# EAGLE design IRsens (EAGLE 9.3.2)
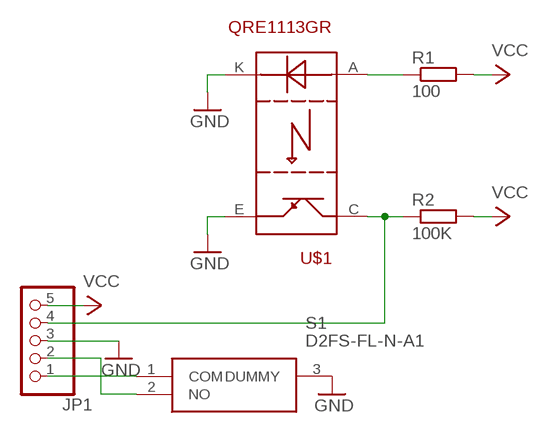
[diagram p0: schematic, sheet 1]

## Parts
JP1  PINHD-1X5  [1X05]
R1  100  R-EU_R0805  [R0805]
R2  100K  R-EU_R0805  [R0805]
S1  D2FS-FL-N-A1  [D2FS-FL-N-A1]
U$1  QRE1113GR  [4LEADSMD]

## Nets
GND: JP1.3 S1.3(DUMMY) U$1.E U$1.K
N$1: R1.1 U$1.A
N$2: JP1.4 R2.1 U$1.C
N$3: JP1.2 S1.2(NO)
N$4: JP1.1 S1.1(COM)
VCC: JP1.5 R1.2 R2.2

## Library data of the parts
JP1 = pinhead:PINHD-1X5: PIN HEADER
R1 R2 = rcl:R-EU_: RESISTOR, European symbol; SPICEPREFIX: R
S1 = D2FS-FL-N-A1:D2FS-FL-N-A1: Microswitch, SPST-NO, lever operated, right angle Source: Datasheet <http://uk.rs-online.com/web/p/products/8046183>; ALLIED_NUMBER: 70454797; DESCRIPTION: Microswitch, SPST-NO, lever operated, right angle; HEIGHT: mm; MANUFACTURER_NAME: Omron Electronics; MANUFACTURER_PART_NUMBER: D2FS-FL-N-A1; RS_PART_NUMBER: 8046183; RS_PRICE-STOCK: http://uk.rs-online.com/web/p/products/8046183
U$1 = QRE1113GR:QRE1113GR; AVAILABILITY: Unavailable; DESCRIPTION: QRE1113 Series 30 V 50 mA Miniature Reflective Object Sensor - SMD-4; MF: ON Semiconductor; MP: QRE1113GR; PACKAGE: SMD-4 ON Semiconductor; PRICE: None

## Board
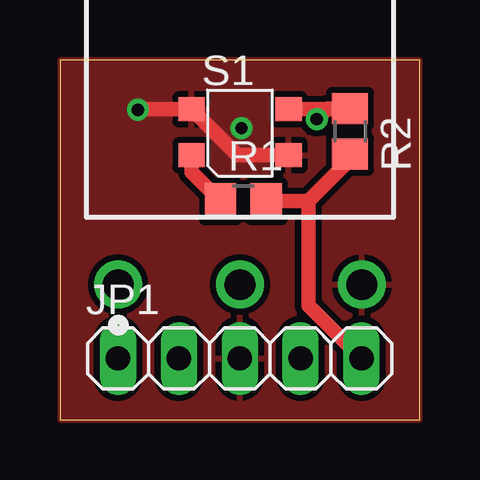
[diagram p1: board, top side]
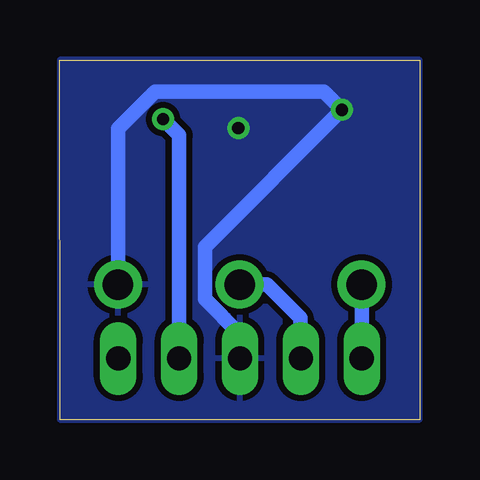
[diagram p2: board, bottom side, seen from below]

Size 15.01 x 15 mm. Coordinates in mm from the lower left corner, seen from the top.
Outline: 0,0 15,0 15.01,15 0,15 0,0
Copper layers (1*16): Top 0.035mm / dielectric 1.5mm / Bottom 0.035mm
Design rules "default *": minimum track width 6mil, minimum drill 0.35mm, track to track 6mil, track to pad 6mil, pad to pad 6mil, via to via 6mil, smd to smd 6mil, copper to edge 0mil, drill to drill 6mil, minimum pad ring 10mil, minimum via ring 8mil, stop-mask expansion 4mil, vias tented up to drill 0mil, thermal gap 10mil

### Footprints (pad centres in the part's own frame; a part is rotated, then mirrored left to right if it is on the bottom)
1X05 = drill 1.016 long: 1 -5.08,0; 2 -2.54,0; 3 0,0; 4 2.54,0; 5 5.08,0
R0805 = smd 1.3 x 1.5: 1 -0.95,0; 2 0.95,0
D2FS-FL-N-A1 = drill 1.28 pad 2: 1 -5.08,-2.8; 2 0,-2.8; 3 5.08,-2.8
4LEADSMD = smd 1.1 x 1: A -2.01,-0.97; C 2.04,0.94; E -2.01,0.94; K 2.04,-0.97

### Placement (x,y rotation side)
JP1  7.5,2.55 0 top
R1  7.65,9.11 0 top
R2  12.1,12.02 270 top
S1  7.51,8.43 0 top
U$1  7.5,12 0 top
U$2  [METRIC_15]  0,0 90 top
U$3  [METRIC_15]  0,0 180 bottom
U$4  [METRIC_15]  7.5,0 90 bottom
U$5  [METRIC_15]  0,15 0 top
U$6  [METRIC_15]  2.42,5.65 90 bottom

### Tracks (layer width: path | path; a pad name or v marks a point on that pad's centre or on a via)
GND  (via drill 0.51)
  Top 0.61: U$1.K 7.4,11.03 U$1.E 3.27,12.94 v3.25,12.92
  Bottom 0.61: S1.3 12.59,12.13 11.04,13.68 4.01,13.68 v3.25,12.92 8.97,7.2 8.97,5.03 7.5,3.56 JP1.3
  other vias: 7.57,12.16
  pour Bottom (isolate 0.254): 0,0 0,15.01 15.01,15.01 15.01,0 0.01,0
  pour Top (isolate 0.254): 0,0 15,0 15,14.98 0,14.98
N$1
  Top 0.61: R1.1 5.49,10.32 U$1.A
N$2  (via drill 0.51)
  Top 0.61: v10.71,12.53 11.15,12.97 R2.1 12.07,12.94 U$1.C
  Bottom 0.61: JP1.4 10.04,11.86 v10.71,12.53
N$3
  Bottom 0.61: S1.2 6.38,5.63 4.98,4.23 4.98,2.57 JP1.2
N$4
  Bottom 0.61: JP1.1 S1.1
VCC
  Top 0.61: R1.2 10.36,9.11 | R2.2 12.1,10.85 10.36,9.11 | JP1.5 10.36,4.77 10.36,9.11